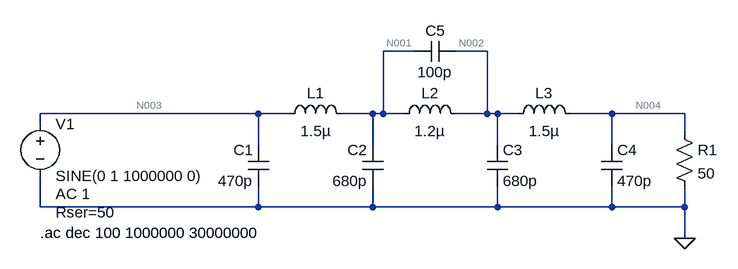
[diagram p0: schematic Butter_Low_Pass_7MHz.asc]
Butter_Low_Pass_7MHz.asc, the LTspice schematic file:
Version 4
SHEET 1 1144 680
WIRE 592 0 544 0
WIRE 704 0 656 0
WIRE 352 96 16 96
WIRE 400 96 352 96
WIRE 528 96 480 96
WIRE 544 96 544 0
WIRE 544 96 528 96
WIRE 576 96 544 96
WIRE 704 96 704 0
WIRE 704 96 656 96
WIRE 720 96 704 96
WIRE 752 96 720 96
WIRE 896 96 832 96
WIRE 1008 96 896 96
WIRE 16 112 16 96
WIRE 1008 128 1008 96
WIRE 352 144 352 96
WIRE 528 144 528 96
WIRE 720 144 720 96
WIRE 896 144 896 96
WIRE 16 240 16 192
WIRE 352 240 352 208
WIRE 352 240 16 240
WIRE 528 240 528 208
WIRE 528 240 352 240
WIRE 720 240 720 208
WIRE 720 240 528 240
WIRE 896 240 896 208
WIRE 896 240 720 240
WIRE 1008 240 1008 208
WIRE 1008 240 896 240
WIRE 1008 288 1008 240
FLAG 1008 288 0
SYMBOL voltage 16 96 R0
WINDOW 123 24 124 Left 2
WINDOW 39 24 152 Left 2
SYMATTR Value2 AC 1
SYMATTR SpiceLine Rser=50
SYMATTR InstName V1
SYMATTR Value SINE(0 1 1000000 0)
SYMBOL ind 384 112 R270
WINDOW 0 32 56 VTop 2
WINDOW 3 5 56 VBottom 2
SYMATTR InstName L1
SYMATTR Value 1.5µ
SYMBOL ind 560 112 R270
WINDOW 0 32 56 VTop 2
WINDOW 3 5 56 VBottom 2
SYMATTR InstName L2
SYMATTR Value 1.2µ
SYMBOL ind 736 112 R270
WINDOW 0 32 56 VTop 2
WINDOW 3 5 56 VBottom 2
SYMATTR InstName L3
SYMATTR Value 1.5µ
SYMBOL res 992 112 R0
SYMATTR InstName R1
SYMATTR Value 50
SYMBOL cap 368 208 R180
WINDOW 0 24 56 Left 2
WINDOW 3 24 8 Left 2
SYMATTR InstName C1
SYMATTR Value 470p
SYMBOL cap 544 208 R180
WINDOW 0 24 56 Left 2
WINDOW 3 24 8 Left 2
SYMATTR InstName C2
SYMATTR Value 680p
SYMBOL cap 704 144 R0
SYMATTR InstName C3
SYMATTR Value 680p
SYMBOL cap 880 144 R0
SYMATTR InstName C4
SYMATTR Value 470p
SYMBOL cap 656 -16 R90
WINDOW 0 0 32 VBottom 2
WINDOW 3 32 32 VTop 2
SYMATTR InstName C5
SYMATTR Value 100p
TEXT 16 280 Left 2 !.ac dec 100 1000000 30000000

The netlist it stands for:
* Butter_Low_Pass_7MHz.asc
V1 N003 0 SINE(0 1 1000000 0) AC 1 Rser=50
L1 N003 N001 1.5µ
L2 N001 N002 1.2µ
L3 N002 N004 1.5µ
R1 N004 0 50
C1 0 N003 470p
C2 0 N001 680p
C3 N002 0 680p
C4 N004 0 470p
C5 N002 N001 100p
.ac dec 100 1000000 30000000
.backanno
.end

* Results of the author's LTspice run, read from the files saved beside the schematic
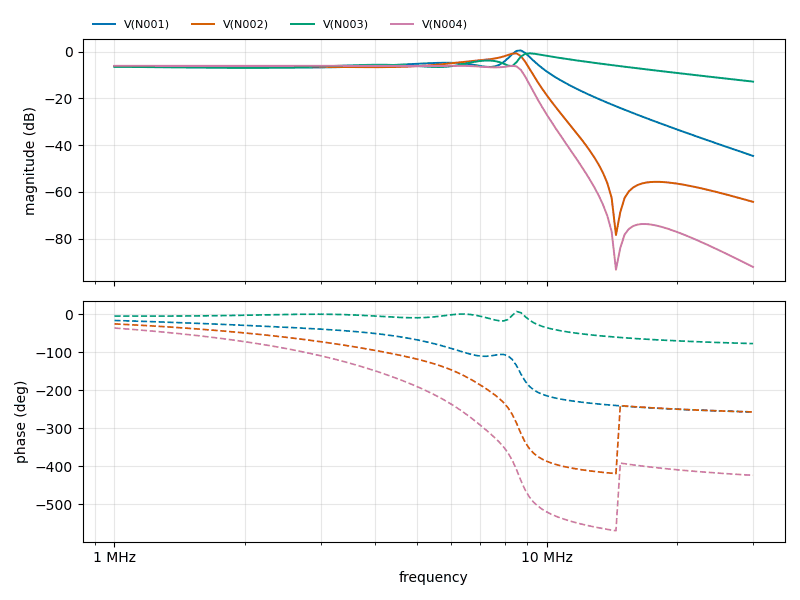
[diagram p1: AC Analysis of Butter_Low_Pass_7MHz.asc, plotted from the saved traces]
* AC Analysis, 1 run:
*   V(N001): -6.25 dB at 1 MHz, -44.60 dB at 30 MHz, peak 0.55 dB at 8.71 MHz, 3 dB below the peak at 8.171 MHz and 9.149 MHz
*   V(N002): -6.14 dB at 1 MHz, -64.27 dB at 30 MHz, peak -0.73 dB at 8.511 MHz, 3 dB below the peak at 6.914 MHz and 8.866 MHz
*   V(N003): -6.44 dB at 1 MHz, -12.80 dB at 30 MHz, peak -0.69 dB at 9.12 MHz, 3 dB below the peak at 8.574 MHz and 11.7 MHz
*   V(N004): -6.05 dB at 1 MHz, -92.12 dB at 30 MHz, peak -6.02 dB at 3.311 MHz, 3 dB below the peak at 8.798 MHz